# Altium schematic sheet PG13_ USB Ports.SchDoc
size 420 x 297 mm
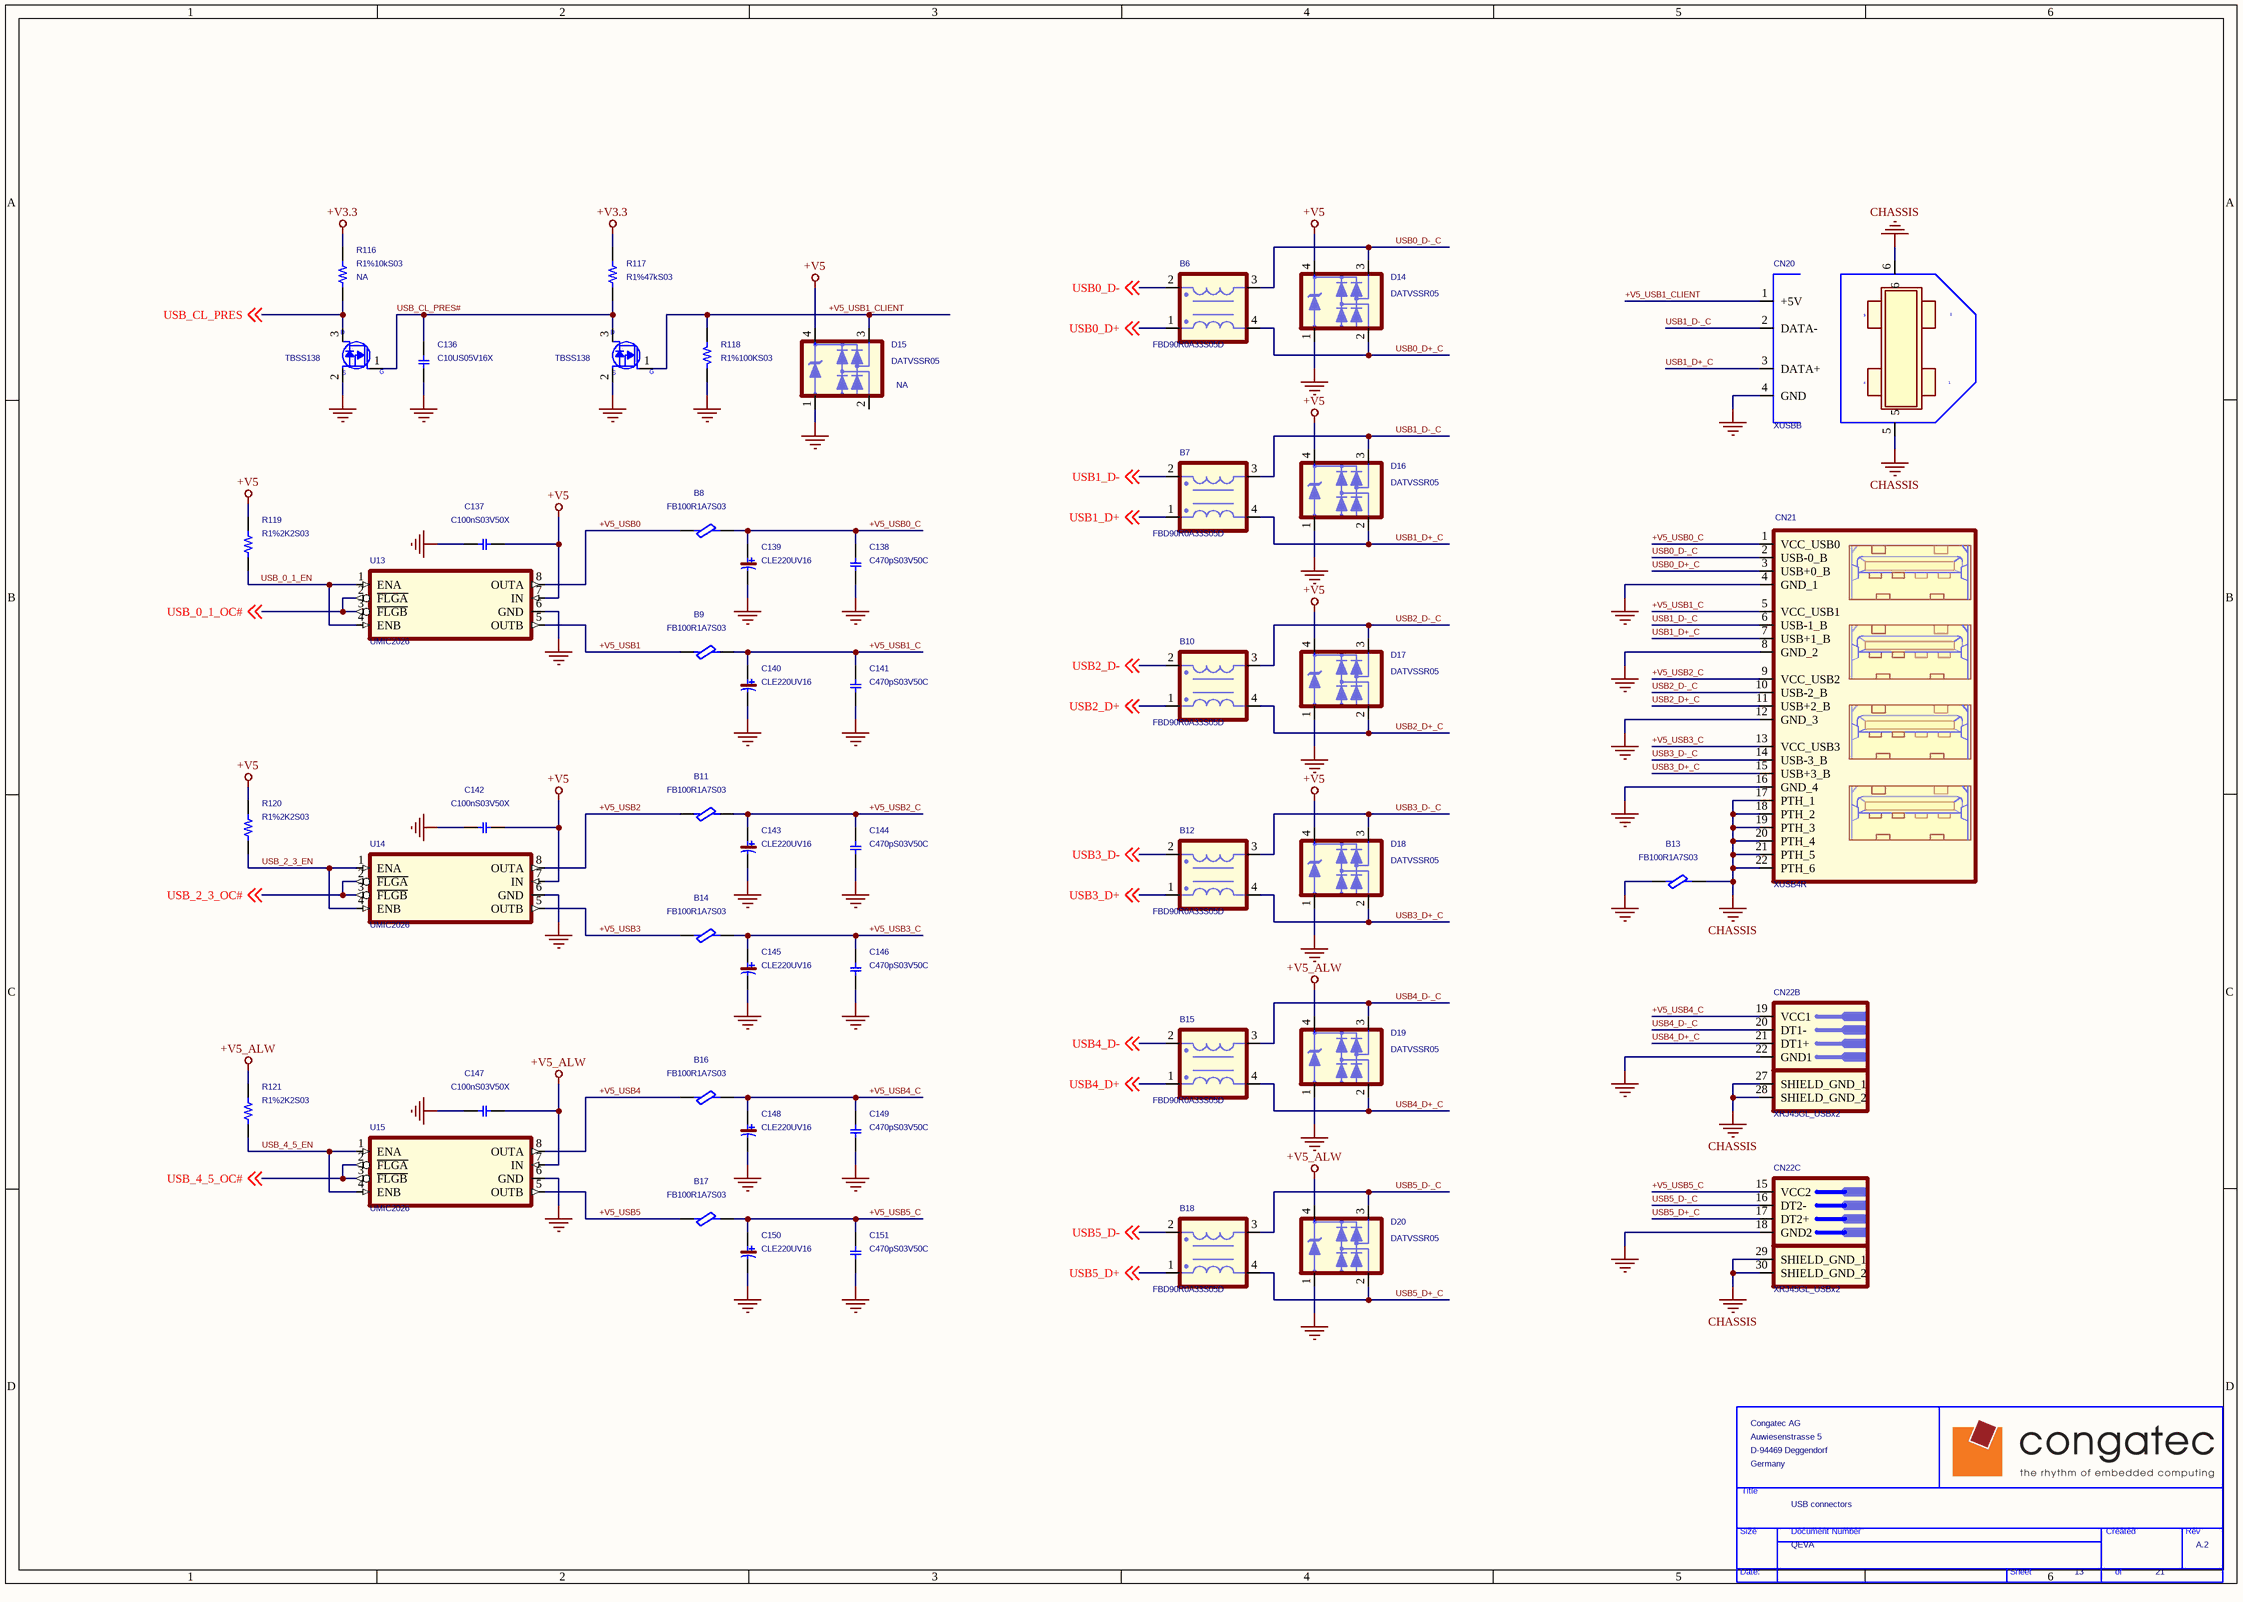
[diagram p0: PG13_ USB Ports.SchDoc]

## Parts
*  Page Count: 21  Page Number: 13  Title: USB connectors  RevCode: A.2  Doc: QEVA  OrgName: Congatec AG  OrgAddr1: Auwiesenstrasse 5  OrgAddr2: D-94469 Deggendorf  OrgAddr3: Germany  (hidden comment: TitleBlock_CONGA)  (graphical)
B6  FBD90R0A33S05D  [ACM2012]
B7  FBD90R0A33S05D  [ACM2012]
B8  FB100R1A7S03  [L0603]
B9  FB100R1A7S03  [L0603]
B10  FBD90R0A33S05D  [ACM2012]
B11  FB100R1A7S03  [L0603]
B12  FBD90R0A33S05D  [ACM2012]
B13  FB100R1A7S03  [L0603]
B14  FB100R1A7S03  [L0603]
B15  FBD90R0A33S05D  [ACM2012]
B16  FB100R1A7S03  [L0603]
B17  FB100R1A7S03  [L0603]
B18  FBD90R0A33S05D  [ACM2012]
C136  C10US05V16X  [C0805]
C137  C100nS03V50X  [C0603]
C138  C470pS03V50C  [C0603]
C139  CLE220UV16  [OEC-D]
C140  CLE220UV16  [OEC-D]
C141  C470pS03V50C  [C0603]
C142  C100nS03V50X  [C0603]
C143  CLE220UV16  [OEC-D]
C144  C470pS03V50C  [C0603]
C145  CLE220UV16  [OEC-D]
C146  C470pS03V50C  [C0603]
C147  C100nS03V50X  [C0603]
C148  CLE220UV16  [OEC-D]
C149  C470pS03V50C  [C0603]
C150  CLE220UV16  [OEC-D]
C151  C470pS03V50C  [C0603]
CN20  XUSBB  [USB-BT-V]
CN21  XUSB4R  [USBX4-V]
CN22  XRJ45GL_USBx2  [RJ45-P3515619W9]  (parts B,C of 3)
D14  DATVSSR05  [SOT-143-SR05]
D15  DATVSSR05  Mounted: NA  [SOT-143-SR05]
D16  DATVSSR05  [SOT-143-SR05]
D17  DATVSSR05  [SOT-143-SR05]
D18  DATVSSR05  [SOT-143-SR05]
D19  DATVSSR05  [SOT-143-SR05]
D20  DATVSSR05  [SOT-143-SR05]
Q11  TBSS138  [SOT-23A]
Q12  TBSS138  [SOT-23A]
R116  R1%10kS03  Mounted: NA  [R0603]
R117  R1%47kS03  [R0603]
R118  R1%100KS03  [R0603]
R119  R1%2K2S03  [R0603]
R120  R1%2K2S03  [R0603]
R121  R1%2K2S03  [R0603]
U13  UMIC2026  [SOIC8]
U14  UMIC2026  [SOIC8]
U15  UMIC2026  [SOIC8]

## Nets
+V3.3: R116.1 R117.1
+V5: C137.2 C142.2 D14.4(CATHODE) D15.4(CATHODE) D16.4(CATHODE) D17.4(CATHODE) D18.4(CATHODE) R119.2 R120.2 U13.7(IN) U14.7(IN)
+V5_ALW: C147.2 D19.4(CATHODE) D20.4(CATHODE) R121.2 U15.7(IN)
CHASSIS: B13.2 CN20.5 CN20.6 CN21.17(PTH_1) CN21.18(PTH_2) CN21.19(PTH_3) CN21.20(PTH_4) CN21.21(PTH_5) CN21.22(PTH_6) CN22.27(SHIELD_GND_1) CN22.28(SHIELD_GND_2) CN22.29(SHIELD_GND_1) CN22.30(SHIELD_GND_2)
GND: B13.1 C136.2 C137.1 C138.2 C139.2 C140.2 C141.2 C142.1 C143.2 C144.2 C145.2 C146.2 C147.1 C148.2 C149.2 C150.2 C151.2 CN20.4(GND) CN21.4(GND_1) CN21.8(GND_2) CN21.12(GND_3) CN21.16(GND_4) CN22.18(GND2) CN22.22(GND1) D14.1(ANODE) D15.1(ANODE) D16.1(ANODE) D17.1(ANODE) D18.1(ANODE) D19.1(ANODE) D20.1(ANODE) Q11.2(S) Q12.2(S) R118.1 U13.6(GND) U14.6(GND) U15.6(GND)
+V5_USB0: B8.1 U13.8(OUTA)
+V5_USB0_C: B8.2 C138.1 C139.1 CN21.1(VCC_USB0)
+V5_USB1: B9.1 U13.5(OUTB)
+V5_USB1_C: B9.2 C140.1 C141.1 CN21.5(VCC_USB1)
+V5_USB1_CLIENT: CN20.1(+5V) D15.3 Q12.1(G) R118.2
+V5_USB2: B11.1 U14.8(OUTA)
+V5_USB2_C: B11.2 C143.1 C144.1 CN21.9(VCC_USB2)
+V5_USB3: B14.1 U14.5(OUTB)
+V5_USB3_C: B14.2 C145.1 C146.1 CN21.13(VCC_USB3)
+V5_USB4: B16.1 U15.8(OUTA)
+V5_USB4_C: B16.2 C148.1 C149.1 CN22.19(VCC1)
+V5_USB5: B17.1 U15.5(OUTB)
+V5_USB5_C: B17.2 C150.1 C151.1 CN22.15(VCC2)
USB0_D+: B6.1(L1) ; off-sheet USB0_D+
USB0_D+_C: B6.4(L4) CN21.3(USB+0_B) D14.2
USB0_D-: B6.2(L2) ; off-sheet USB0_D-
USB0_D-_C: B6.3(L3) CN21.2(USB-0_B) D14.3
USB1_D+: B7.1(L1) ; off-sheet USB1_D+
USB1_D+_C: B7.4(L4) CN20.3(DATA+) CN21.7(USB+1_B) D16.2
USB1_D-: B7.2(L2) ; off-sheet USB1_D-
USB1_D-_C: B7.3(L3) CN20.2(DATA-) CN21.6(USB-1_B) D16.3
USB2_D+: B10.1(L1) ; off-sheet USB2_D+
USB2_D+_C: B10.4(L4) CN21.11(USB+2_B) D17.2
USB2_D-: B10.2(L2) ; off-sheet USB2_D-
USB2_D-_C: B10.3(L3) CN21.10(USB-2_B) D17.3
USB3_D+: B12.1(L1) ; off-sheet USB3_D+
USB3_D+_C: B12.4(L4) CN21.15(USB+3_B) D18.2
USB3_D-: B12.2(L2) ; off-sheet USB3_D-
USB3_D-_C: B12.3(L3) CN21.14(USB-3_B) D18.3
USB4_D+: B15.1(L1) ; off-sheet USB4_D+
USB4_D+_C: B15.4(L4) CN22.21(DT1+) D19.2
USB4_D-: B15.2(L2) ; off-sheet USB4_D-
USB4_D-_C: B15.3(L3) CN22.20(DT1-) D19.3
USB5_D+: B18.1(L1) ; off-sheet USB5_D+
USB5_D+_C: B18.4(L4) CN22.17(DT2+) D20.2
USB5_D-: B18.2(L2) ; off-sheet USB5_D-
USB5_D-_C: B18.3(L3) CN22.16(DT2-) D20.3
USB_0_1_EN: R119.1 U13.1(ENA) U13.4(ENB)
USB_0_1_OC#: U13.2(~{FLGA}) U13.3(~{FLGB}) ; off-sheet USB_0_1_OC#
USB_2_3_EN: R120.1 U14.1(ENA) U14.4(ENB)
USB_2_3_OC#: U14.2(~{FLGA}) U14.3(~{FLGB}) ; off-sheet USB_2_3_OC#
USB_4_5_EN: R121.1 U15.1(ENA) U15.4(ENB)
USB_4_5_OC#: U15.2(~{FLGA}) U15.3(~{FLGB}) ; off-sheet USB_4_5_OC#
USB_CL_PRES: Q11.3(D) R116.2 ; off-sheet USB_CL_PRES
USB_CL_PRES#: C136.1 Q11.1(G) Q12.3(D) R117.2

Not connected (* = marked no-connect by the designer): D15 2

## Notes on the sheet
- (in symbol TitleBlock_CONGA) Title; Size; Document Number; Created; Rev; Date:; Sheet; of

## Library data of the parts
B6 B7 B10 B12 B15 B18 = 1212_FILTER_0: * Inductor Common-MODE FILTER ACM2012-900-2P SMD; Part_Number: 43500027; Part Number: 1212309007; Manufacture Part Number: ACM2012-900-2P-TL; BOM_Level: 1; ProcessType: SMT; Revision: A; Package: 2.0*1.2*1.3mm
B8 B9 B11 B14 B16 B17 = 1212_BEAD_0: Bead 120 +-25% 2A SMD 0603 BLM18PG121SN1 WO/Pb; Part_Number: 43500008; Part Number: 1212000056; BOM_Level: 1; Tolerance: 25%; ProcessType: SMT; Revision: B; Package: 0603; Manufacture Part Number: BLM18PG121SN1
B13 = 1212_BEAD_0: Bead 120 +-25% 2A SMD 0603 BLM18PG121SN1 WO/Pb; Part_Number: 43500008; Part Number: 1212000056; BOM_Level: 1; ProcessType: SMT; Tolerance: 25%; Revision: B; Manufacture Part Number: BLM18PG121SN1; Package: 0603
C136 = 11_C_0: CAP 10u 6.3V +/-10% SMD 0805 MLCC X5R KEMET; Part Number: 1100000316; Manufacture Part Number: C0805C106K9PAC; Part_Number: 41000185; Tolerance: 10%; ProcessType: SMT; BOM_Level: 1; Package: 0805; Revision: A
C137 = 11_C_0: CAP 0.1U 50V +-10% SMD 0603 X7R WO/Pb; Part_Number: 41000289; Manufacture Part Number: C1608X7R1H104KT試223858615649; Part Number: 1100000214; BOM_Level: 1; ProcessType: SMT; Tolerance: 10%; Revision: A; Package: 0603
C138 C141 C144 C146 C149 C151 = 11_C_0: CAP 470pF 50V 10% 0603 SMD  MCC; Part_Number: 41000322; Part Number: 1124547180; Manufacture Part Number: 2238 586 15618試0603試NPO50/100/200/500V試2238 586 15618試223858615618試CC0603KRX7R9BB471試C1608X7R1H471K試0603B152K500LT; BOM_Level: 1; ProcessType: SMT; Revision: A; Tolerance: 10%; Package: 0603
C139 C140 C143 C145 C148 C150 = 11_C_POLAR_0: *CAP 220uF 16V +-20% SMD 6.3?*7.7 EC LOW ESR; Part_Number: 41000366; Part Number: 1111622190; Manufacture Part Number: MVY16V220MF80試16CE220AX; BOM_Level: 1; Tolerance: 20%; ProcessType: SMT; Revision: A; Package: EC-?6.3*7.7MM
C142 C147 = 11_C_0: CAP 0.1U 50V +-10% SMD 0603 X7R WO/Pb; Part Number: 1100000214; Manufacture Part Number: C1608X7R1H104KT試223858615649; Part_Number: 41000289; Tolerance: 10%; ProcessType: SMT; BOM_Level: 1; Package: 0603; Revision: A
CN20 = 1654_USB-BT-V_0: USB CONN. 4P 90D(M) TYPE B SUYIN; Part_Number: 41500326; Manufacture Part Number: 020123MR004S200PA; Part Number: 1654904300; BOM_Level: 1; ProcessType: DIP; Revision: A; Package: USB4P
CN21 = 1654_USBX4-V_ATYPE_0: USB CONN. 16P 90D(M) DIP 4PORT TYPE A; Part Number: 1654000162; Manufacture Part Number: 0-1734383-1; Part_Number: 41500036; BOM_Level: 1; Package: USBx4-16P; ProcessType: DIP; Revision: A
CN22 = 1652_RJ45-P3515619W9_0: PhoneJack RJ45+USB*2 90D(F) W/LED&XFMR DIP; Part NUmber: 165250820M; Part_Number: 41500328; Manufacture Part Number: P25@156-P9W9; BOM_Level: 1; Revision: A; Package: RJ45+USBx2+XFMR; ProcessType: DIP
D14 D16-D18 = 130_TVS_SOT-143-SR05_0: Diode TVS SR05.TCT SMD SOT-143 4P 15KV SEMTECH; Part_Number: 42500011; Manufacture(English): Semtech International Ag; Manufacture: ???????????(Semtech International Ag); Part Number: 1300000127; BOM_Level: 1; ProcessType: SMT; Revision: A; Manufacture Part Number: SR05.TCT; Package: SOT-143
D15 = 130_TVS_SOT-143-SR05_0: Diode TVS SR05.TCT SMD SOT-143 4P 15KV SEMTECH; Manufacture(English): Semtech International Ag; Manufacture: ???????????(Semtech International Ag); Part Number: 1300000127; Part_Number: 42500011; ProcessType: SMT; Characteristic: 6V; BOM_Level: 1; Manufacture Part Number: SR05.TCT; Package: SOT-143; Revision: A
D19 D20 = 130_TVS_SOT-143-SR05_0: Diode TVS SR05.TCT SMD SOT-143 4P 15KV SEMTECH; Part_Number: 42500011; Part Number: 1300000127; Manufacture: ???????????(Semtech International Ag); Manufacture(English): Semtech International Ag; BOM_Level: 1; ProcessType: SMT; Revision: A; Package: SOT-143; Manufacture Part Number: SR05.TCT
Q11 Q12 = 131_SOT-23A_GSD_0: MOSFET MPN BSS138_NL SMD SOT-23 3P 50V N-channe; Part_Number: 44000026; Part Number: 1310000011; BOM_Level: 1; ProcessType: SMT; Revision: B; Manufacture Part Number: BSS138_NL; Package: SOT-23
R116 = 10_R_0_Dup1: R 10K 1/10W 1% SMD 0603 CR WO/Pb; Manufacture Part Number: RCT02***FTP試0603WAF1002T5E試2322 704 61003L試RC0603FR-0710KL試RM06FTN1002試WR06X8200JT; Part Number: 105A510023; Part_Number: 45502052; ProcessType: SMT; BOM_Level: 1; Package: 0603; Tolerance: 1%; Revision: A
R117 = 10_R_0_Dup1: 47K 1/10W 5% 0603 CR WO/Pb; Manufacture Part Number: 0603WAJ0473T5E試232270260473L試RM06JTN473; Part Number: 105A747029; Part_Number: 45502068; ProcessType: SMT; BOM_Level: 1; Package: 0603; Tolerance: 5%; Revision: A
R118 = 10_R_0_Dup1: R 100K 1/10W 1% SMD 0603 CR; Part_Number: 45501496; Part Number: 105A510033; Manufacture Part Number: 0603WAF1003T5E試232270461004L試RM06FTN1003; BOM_Level: 1; ProcessType: SMT; Revision: A; Tolerance: 1%; Package: 0603
R119-R121 = 10_R_0_Dup1: R 2.2K 1/10W 1% SMD 0603 CR; Part_Number: 45502036; Part Number: 105A522013; Manufacture Part Number: 0603WGF0222T5E試232270462202L試RM06FTN2201; BOM_Level: 1; ProcessType: SMT; Revision: A; Tolerance: 1%; Package: 0603
U13-U15 = 14S_MICREL_MIC2026-1YM_0: IC SMD MIC2026-1YM SOIC8 WO/Pb MICREL; Part_Number: 43000105; Part Number: 14S2202600; BOM_Level: 1; ProcessType: SMT; Revision: A; Manufacture Part Number: MIC2026-1YM; Package: SOIC8
* = TitleBlock_CONGA: Page Create Date: March  8, 1995